# Altium schematic sheet Modbus TCP.SchDoc
size A2
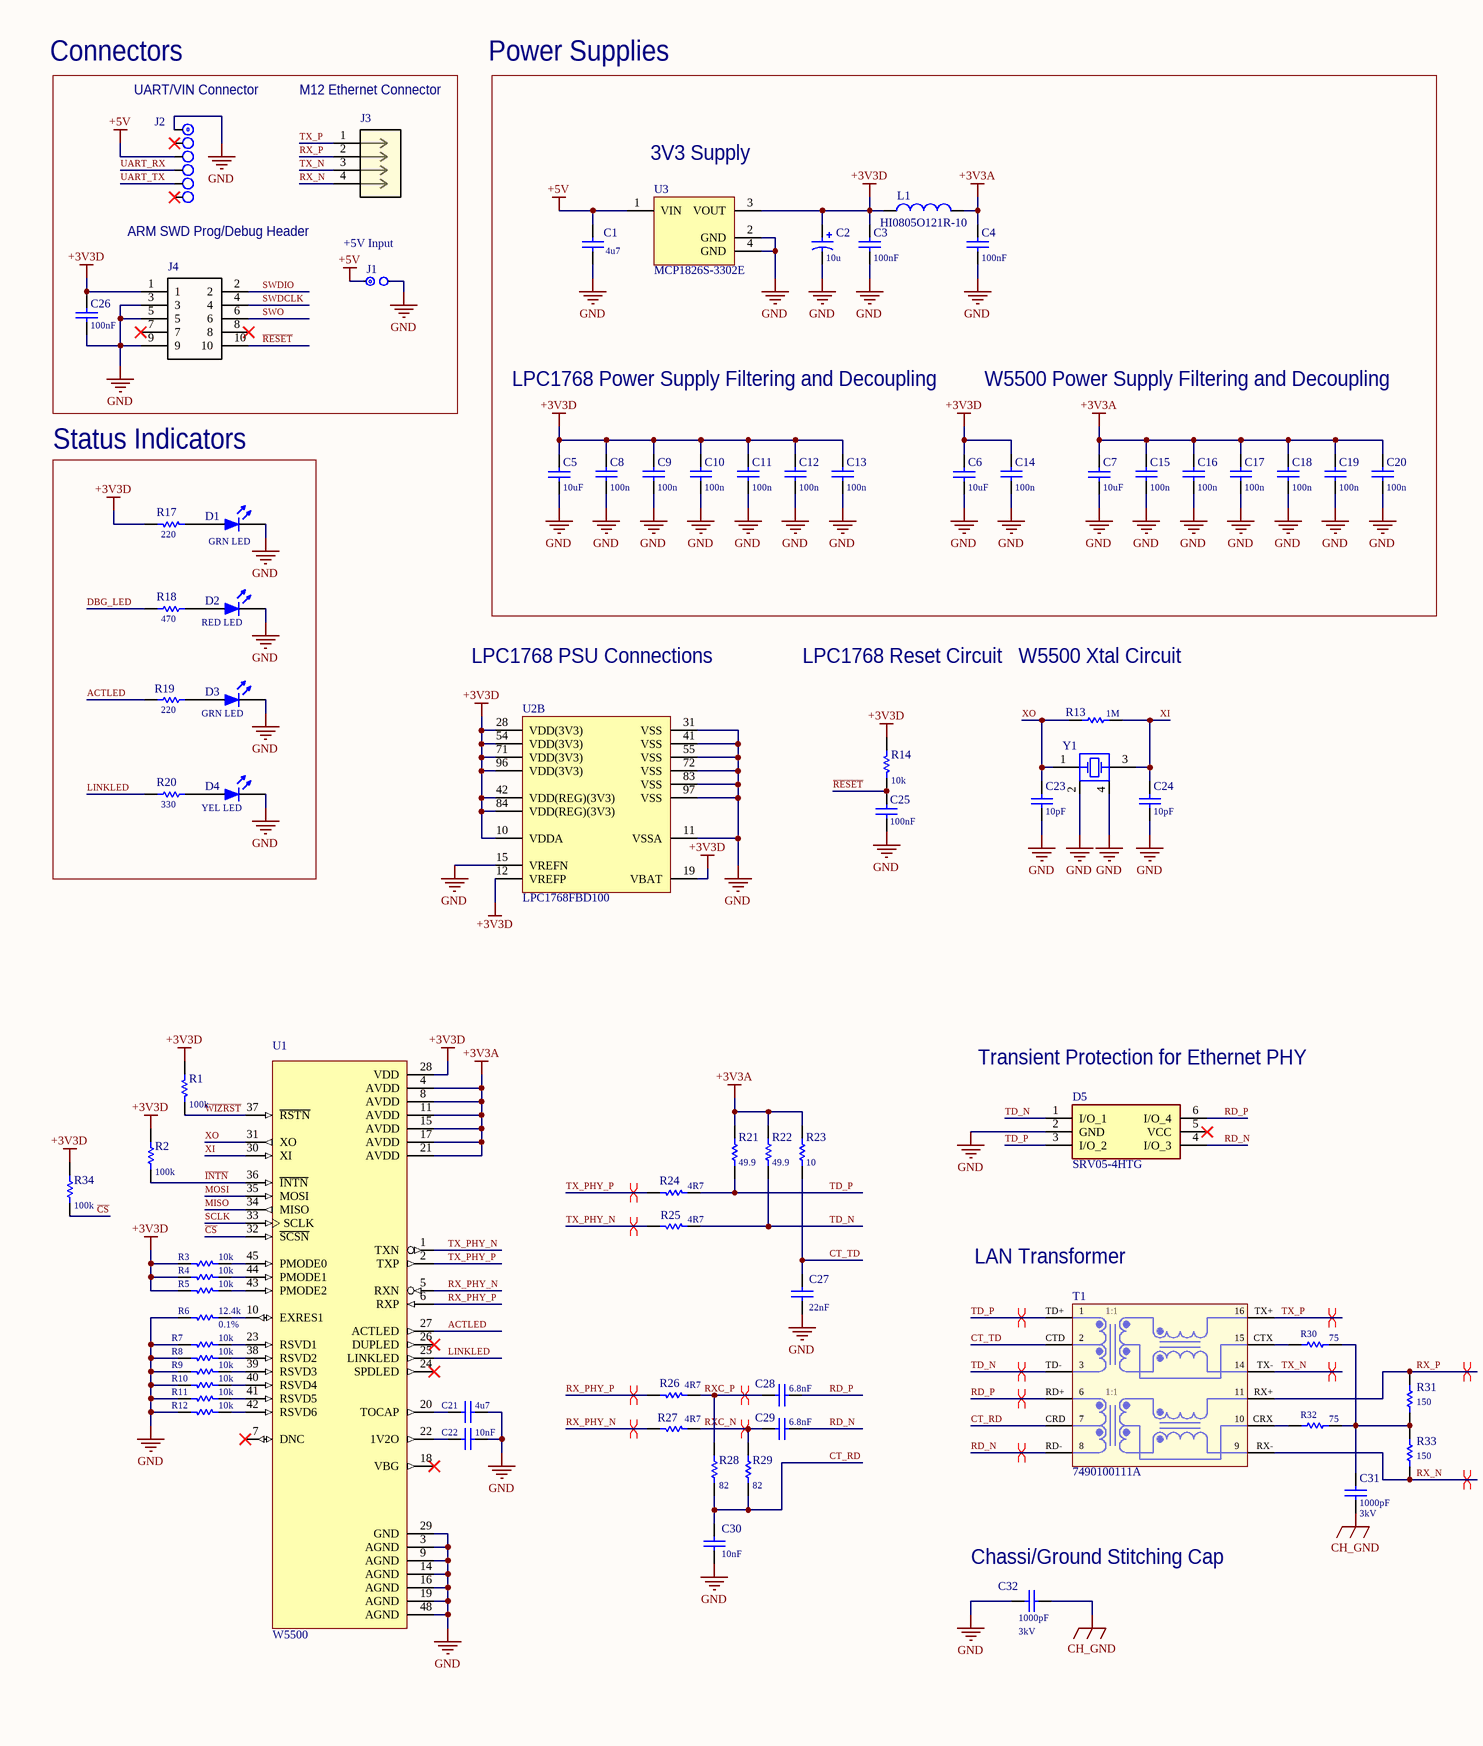
[diagram p0: Modbus TCP.SchDoc, left]
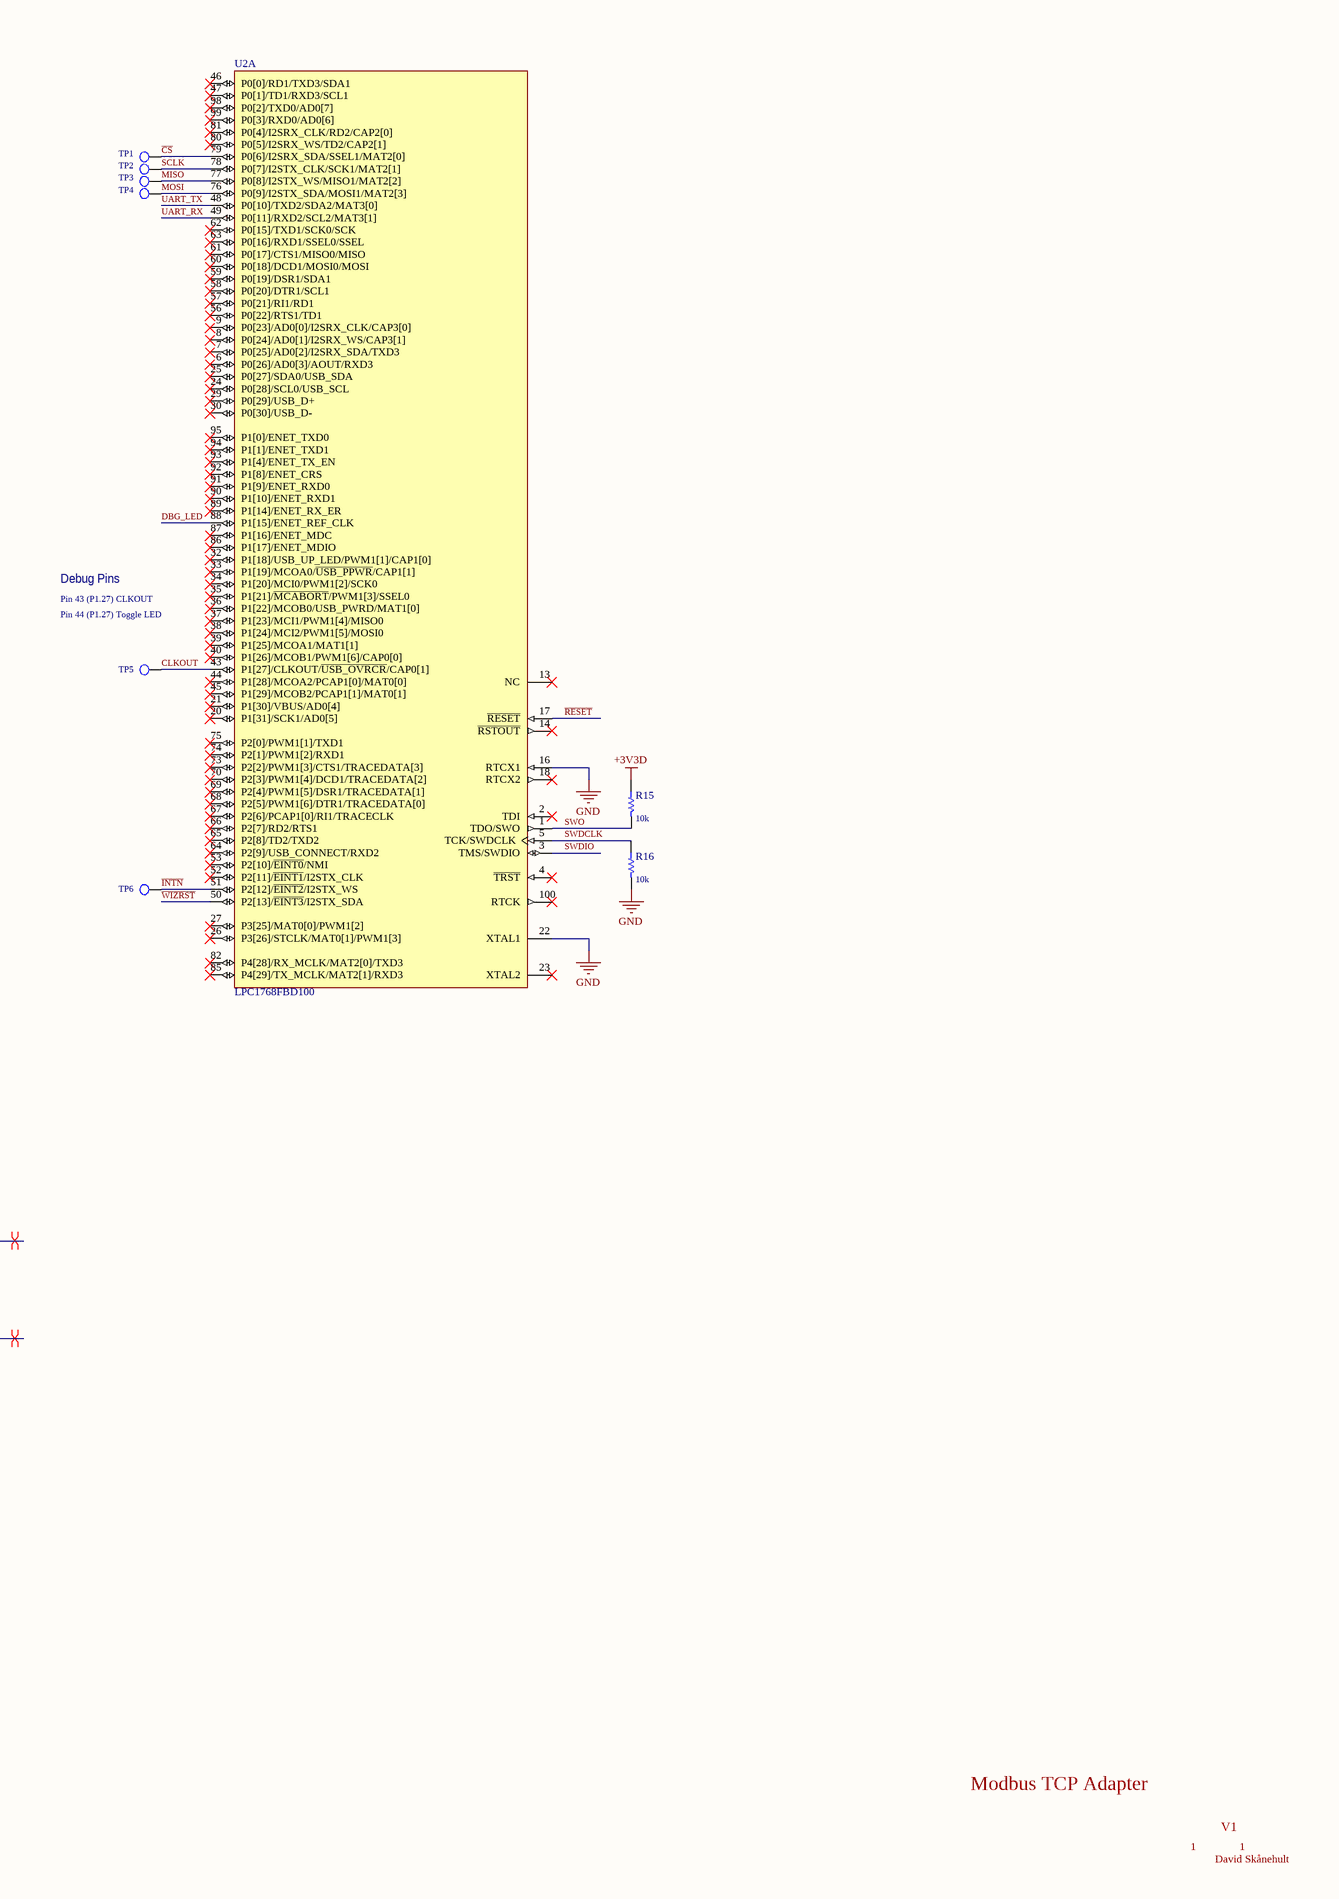
[diagram p1: Modbus TCP.SchDoc, right]

## Parts
C1  value 4u7  [C0805C475K4RACTU]  (hidden comment: CAP_0805-2012)
C2  value 10u  [CAP3528]  (hidden comment: CAP_TANT)
C3  Capacitance: 100nF  [WURTH-CSGP_0402]  (hidden comment: 100nF, 16V)
C4  Capacitance: 100nF  [WURTH-CSGP_0402]  (hidden comment: 100nF, 16V)
C5  value 10uF  [C0805C475K3RACAUTO]  (hidden comment: CAP_0805-2012)
C6  value 10uF  [C0805C475K3RACAUTO]  (hidden comment: CAP_0805-2012)
C7  value 10uF  [C0805C475K3RACAUTO]  (hidden comment: CAP_0805-2012)
C8  Capacitance: 100n  [WURTH-CSGP_0402]  (hidden comment: 100nF, 16V)
C9  Capacitance: 100n  [WURTH-CSGP_0402]  (hidden comment: 100nF, 16V)
C10  Capacitance: 100n  [WURTH-CSGP_0402]  (hidden comment: 100nF, 16V)
C11  Capacitance: 100n  [WURTH-CSGP_0402]  (hidden comment: 100nF, 16V)
C12  Capacitance: 100n  [WURTH-CSGP_0402]  (hidden comment: 100nF, 16V)
C13  Capacitance: 100n  [WURTH-CSGP_0402]  (hidden comment: 100nF, 16V)
C14  Capacitance: 100n  [WURTH-CSGP_0402]  (hidden comment: 100nF, 16V)
C15  Capacitance: 100n  [WURTH-CSGP_0402]  (hidden comment: 100nF, 16V)
C16  Capacitance: 100n  [WURTH-CSGP_0402]  (hidden comment: 100nF, 16V)
C17  Capacitance: 100n  [WURTH-CSGP_0402]  (hidden comment: 100nF, 16V)
C18  Capacitance: 100n  [WURTH-CSGP_0402]  (hidden comment: 100nF, 16V)
C19  Capacitance: 100n  [WURTH-CSGP_0402]  (hidden comment: 100nF, 16V)
C20  Capacitance: 100n  [WURTH-CSGP_0402]  (hidden comment: 100nF, 16V)
C21  value 4u7  [C0805C475K4RACTU]  (hidden comment: CAP_0805-2012)
C22  Capacitance: 10nF  [WURTH-CSGP_0402]  (hidden comment: 10nF, 25V)
C23  Capacitance: 10pF  [WURTH-CSGP_0402]  (hidden comment: 10pF, 25V)
C24  Capacitance: 10pF  [WURTH-CSGP_0402]  (hidden comment: 10pF, 25V)
C25  Capacitance: 100nF  [WURTH-CSGP_0402]  (hidden comment: 100nF, 16V)
C26  Capacitance: 100nF  [WCAP-CSGP_0402]  (hidden comment: 100nF, 16V)
C27  Capacitance: 22nF  [WURTH-CSGP_0402]  (hidden comment: 22nF, 25V)
C28  Capacitance: 6.8nF  [WURTH-CSGP_0603_Reflow]  (hidden comment: 6.8nF, 50V)
C29  Capacitance: 6.8nF  [WURTH-CSGP_0603_Reflow]  (hidden comment: 6.8nF, 50V)
C30  Capacitance: 10nF  [WURTH-CSGP_0402]  (hidden comment: 10nF, 25V)
C31  value 1000pF  Value2: 3kV  [C1812C102KHRACTU]  (hidden comment: CAP_1812-4532)
C32  value 1000pF  Value2: 3kV  [C1812C102KHRACTU]  (hidden comment: CAP_1812-4532)
D1  GRN LED  [KPG-1608]
D2  RED LED  [KPG-1608]
D3  GRN LED  [KPG-1608]
D4  YEL LED  [KPG-1608]
D5  SRV05-4HTG  [SOT95P280X145-6N]
J1  +5V Input  [J1x2]
J2  UART/VIN Connector  [HR-1x6]
J3  M12 Ethernet Connector  [CONN4_T414351204]
J4  ARM SWD Prog/Debug Header  [*SAMTEC_FTSH-105-01-L-DV-K]
L1  HI0805O121R-10  [HI0805O121R-10]
R1  value 100k  [RESC1005N - PANASONIC]  (hidden comment: RES_0402-1005)
R2  value 100k  [RESC1005N - PANASONIC]  (hidden comment: RES_0402-1005)
R3  value 10k  [RESC1005N - PANASONIC]  (hidden comment: RES_0402-1005)
R4  value 10k  [RESC1005N - PANASONIC]  (hidden comment: RES_0402-1005)
R5  value 10k  [RESC1005N - PANASONIC]  (hidden comment: RES_0402-1005)
R6  value 12.4k  Value2: 0.1%  [RESC1608N - PANASONIC ERJ]  (hidden comment: RES_0603-1608)
R7  value 10k  [RESC1005N - PANASONIC]  (hidden comment: RES_0402-1005)
R8  value 10k  [RESC1005N - PANASONIC]  (hidden comment: RES_0402-1005)
R9  value 10k  [RESC1005N - PANASONIC]  (hidden comment: RES_0402-1005)
R10  value 10k  [RESC1005N - PANASONIC]  (hidden comment: RES_0402-1005)
R11  value 10k  [RESC1005N - PANASONIC]  (hidden comment: RES_0402-1005)
R12  value 10k  [RESC1005N - PANASONIC]  (hidden comment: RES_0402-1005)
R13  value 1M  [RESC1005N - PANASONIC]  (hidden comment: RES_0402-1005)
R14  value 10k  [RESC1005N - PANASONIC]  (hidden comment: RES_0402-1005)
R15  value 10k  [RESC1005N - PANASONIC]  (hidden comment: RES_0402-1005)
R16  value 10k  [RESC1005N - PANASONIC]  (hidden comment: RES_0402-1005)
R17  value 220  [RESC1005N - PANASONIC]  (hidden comment: RES_0402-1005)
R18  value 470  [RESC1005N - PANASONIC]  (hidden comment: RES_0402-1005)
R19  value 220  [RESC1005N - PANASONIC]  (hidden comment: RES_0402-1005)
R20  value 330  [RESC1005N - PANASONIC]  (hidden comment: RES_0402-1005)
R21  value 49.9  [RESC1005N - PANASONIC]  (hidden comment: RES_0402-1005)
R22  value 49.9  [RESC1005N - PANASONIC]  (hidden comment: RES_0402-1005)
R23  value 10  [RESC1005N - PANASONIC]  (hidden comment: RES_0402-1005)
R24  value 4R7  [RESC1005N - PANASONIC]  (hidden comment: RES_0402-1005)
R25  value 4R7  [RESC1005N - PANASONIC]  (hidden comment: RES_0402-1005)
R26  value 4R7  [RESC1005N - PANASONIC]  (hidden comment: RES_0402-1005)
R27  value 4R7  [RESC1005N - PANASONIC]  (hidden comment: RES_0402-1005)
R28  value 82  [RESC1005N - PANASONIC]  (hidden comment: RES_0402-1005)
R29  value 82  [RESC1005N - PANASONIC]  (hidden comment: RES_0402-1005)
R30  value 75  [RESC1608N - PANASONIC ERJ]  (hidden comment: RES_0603-1608)
R31  value 150  [RESC1608N - PANASONIC ERJ]  (hidden comment: RES_0603-1608)
R32  value 75  [RESC1608N - PANASONIC ERJ]  (hidden comment: RES_0603-1608)
R33  value 150  [RESC1608N - PANASONIC ERJ]  (hidden comment: RES_0603-1608)
R34  value 100k  [RESC1005N - PANASONIC]  (hidden comment: RES_0402-1005)
T1  7490100111A  [7490100111A]
TP1  Test Point  [TEST_PAD]  (value not drawn)
TP2  Test Point  [TEST_PAD]  (value not drawn)
TP3  Test Point  [TEST_PAD]  (value not drawn)
TP4  Test Point  [TEST_PAD]  (value not drawn)
TP5  Test Point  [TEST_PAD]  (value not drawn)
TP6  Test Point  [TEST_PAD]  (value not drawn)
U1  W5500  [*QFP50P900X900X160-48N]
U2  LPC1768FBD100  [SOT407-1_V]  (parts A,B of 2)
U3  MCP1826S-3302E  [SOT-223-DB3_N]
Y1  XTAL 4-pin  [IQXC-42]  (value not drawn)

## Blocks framed on the sheet
Status Indicators: D1-D4 R17-R20

## Nets
+3V3A: C4.1 C7.1 C15.1 C16.1 C17.1 C18.1 C19.1 C20.1 L1.2 R21.1 R22.1 R23.1 U1.4(AVDD) U1.8(AVDD) U1.11(AVDD) U1.15(AVDD) U1.17(AVDD) U1.21(AVDD)
+3V3D: C2.2 C3.1 C5.1 C6.1 C8.1 C9.1 C10.1 C11.1 C12.1 C13.1 C14.1 C26.1 J4.1 L1.1 R1.1 R2.1 R3.2 R4.2 R5.2 R14.1 R15.1 R17.2 R34.1 U1.28(VDD) U2.10(VDDA) U2.12(VREFP) U2.19(VBAT) U2.28(VDD(3V3)) U2.42(VDD(REG)(3V3)) U2.54(VDD(3V3)) U2.71(VDD(3V3)) U2.84(VDD(REG)(3V3)) U2.96(VDD(3V3)) U3.3(VOUT)
+5V: C1.1 J1.1 J2.3 U3.1(VIN)
CH_GND: C31.2 C32.2
GND: C1.2 C2.1 C3.2 C4.2 C5.2 C6.2 C7.2 C8.2 C9.2 C10.2 C11.2 C12.2 C13.2 C14.2 C15.2 C16.2 C17.2 C18.2 C19.2 C20.2 C21.2 C22.2 C23.2 C24.2 C25.2 C26.2 C27.2 C30.2 C32.1 D1.2(K) D2.2(K) D3.2(K) D4.2(K) D5.2(GND) J1.2 J2.1 J4.3 J4.5 J4.9 R6.2 R7.2 R8.2 R9.2 R10.2 R11.2 R12.2 R16.2 U1.3(AGND) U1.9(AGND) U1.14(AGND) U1.16(AGND) U1.19(AGND) U1.29(GND) U1.48(AGND) U2.11(VSSA) U2.15(VREFN) U2.16(RTCX1) U2.22(XTAL1) U2.31(VSS) U2.41(VSS) U2.55(VSS) U2.72(VSS) U2.83(VSS) U2.97(VSS) U3.2(GND) U3.4(GND) Y1.2(GND1) Y1.4(GND2)
ACTLED: R19.1 U1.27(ACTLED)
~{CS}: R34.2 TP1.1 U1.32(~{SCSN}) U2.79(P0[6]/I2SRX_SDA/SSEL1/MAT2[0])
CLKOUT: TP5.1 U2.43(P1[27]/CLKOUT/~{USB_OVRCR}/CAP0[1])
CT_RD: C30.1 R28.1 R29.1 T1.7(CRD)
CT_TD: C27.1 R23.2 T1.2(CTD)
DBG_LED: R18.1 U2.88(P1[15]/ENET_REF_CLK)
~{INTN}: R2.2 TP6.1 U1.36(~{INTN}) U2.51(P2[12]/~{EINT2}/I2STX_WS)
LINKLED: R20.1 U1.25(LINKLED)
MISO: TP3.1 U1.34(MISO) U2.77(P0[8]/I2STX_WS/MISO1/MAT2[2])
MOSI: TP4.1 U1.35(MOSI) U2.76(P0[9]/I2STX_SDA/MOSI1/MAT2[3])
~{RESET}: C25.1 J4.10 R14.2 U2.17(~{RESET})
RD_N: C29.2 D5.4(I/O_3) T1.8(RD-)
RD_P: C28.2 D5.6(I/O_4) T1.6(RD+)
RX_N: J3.4 R33.2 T1.9(RX-)
RX_P: J3.2 R31.1 T1.11(RX+)
RX_PHY_N: R27.2 U1.5(RXN)
RX_PHY_P: R26.2 U1.6(RXP)
RXC_N: C29.1 R27.1 R29.2
RXC_P: C28.1 R26.1 R28.2
SCLK: TP2.1 U1.33(SCLK) U2.78(P0[7]/I2STX_CLK/SCK1/MAT2[1])
SWDCLK: J4.4 R16.1 U2.5(TCK/SWDCLK)
SWDIO: J4.2 U2.3(TMS/SWDIO)
SWO: J4.6 R15.2 U2.1(TDO/SWO)
TD_N: D5.1(I/O_1) R22.2 R25.1 T1.3(TD-)
TD_P: D5.3(I/O_2) R21.2 R24.1 T1.1(TD+)
TX_N: J3.3 T1.14(TX-)
TX_P: J3.1 T1.16(TX+)
TX_PHY_N: R25.2 U1.1(TXN)
TX_PHY_P: R24.2 U1.2(TXP)
UART_RX: J2.4 U2.49(P0[11]/RXD2/SCL2/MAT3[1])
UART_TX: J2.5 U2.48(P0[10]/TXD2/SDA2/MAT3[0])
~{WIZRST}: R1.2 U1.37(~{RSTN}) U2.50(P2[13]/~{EINT3}/I2STX_SDA)
XI: C24.1 R13.1 U1.30(XI) Y1.3(OSC2)
XO: C23.1 R13.2 U1.31(XO) Y1.1(OSC1)
NetC21_1: C21.1 U1.20(TOCAP)
NetC22_1: C22.1 U1.22(1V2O)
NetC31_1: C31.1 R30.2 R31.2 R32.2 R33.1
NetD1_1: D1.1(A) R17.1
NetD2_1: D2.1(A) R18.2
NetD3_1: D3.1(A) R19.2
NetD4_1: D4.1(A) R20.2
NetR3_1: R3.1 U1.45(PMODE0)
NetR4_1: R4.1 U1.44(PMODE1)
NetR5_1: R5.1 U1.43(PMODE2)
NetR6_1: R6.1 U1.10(EXRES1)
NetR7_1: R7.1 U1.23(RSVD1)
NetR8_1: R8.1 U1.38(RSVD2)
NetR9_1: R9.1 U1.39(RSVD3)
NetR10_1: R10.1 U1.40(RSVD4)
NetR11_1: R11.1 U1.41(RSVD5)
NetR12_1: R12.1 U1.42(RSVD6)
NetR30_1: R30.1 T1.15(CTX)
NetR32_1: R32.1 T1.10(CRX)

Not connected (* = marked no-connect by the designer): D5 5(VCC)*; J2 2* 6*; J4 7* 8*; U1 7(DNC)* 18(VBG)* 24(SPDLED)* 26(DUPLED)*; U2 2(TDI)* 4(~{TRST})* 6(P0[26]/AD0[3]/AOUT/RXD3)* 7(P0[25]/AD0[2]/I2SRX_SDA/TXD3)* 8(P0[24]/AD0[1]/I2SRX_WS/CAP3[1])* 9(P0[23]/AD0[0]/I2SRX_CLK/CAP3[0])* 13(NC)* 14(~{RSTOUT})* 18(RTCX2)* 20(P1[31]/SCK1/AD0[5])* 21(P1[30]/VBUS/AD0[4])* 23(XTAL2)* 24(P0[28]/SCL0/USB_SCL)* 25(P0[27]/SDA0/USB_SDA)* 26(P3[26]/STCLK/MAT0[1]/PWM1[3])* 27(P3[25]/MAT0[0]/PWM1[2])* 29(P0[29]/USB_D+)* 30(P0[30]/USB_D-)* 32(P1[18]/USB_UP_LED/PWM1[1]/CAP1[0])* 33(P1[19]/MCOA0/~{USB_PPWR}/CAP1[1])* 34(P1[20]/MCI0/PWM1[2]/SCK0)* 35(P1[21]/~{MCABORT}/PWM1[3]/SSEL0)* 36(P1[22]/MCOB0/USB_PWRD/MAT1[0])* 37(P1[23]/MCI1/PWM1[4]/MISO0)* 38(P1[24]/MCI2/PWM1[5]/MOSI0)* 39(P1[25]/MCOA1/MAT1[1])* 40(P1[26]/MCOB1/PWM1[6]/CAP0[0])* 44(P1[28]/MCOA2/PCAP1[0]/MAT0[0])* 45(P1[29]/MCOB2/PCAP1[1]/MAT0[1])* 46(P0[0]/RD1/TXD3/SDA1)* 47(P0[1]/TD1/RXD3/SCL1)* 52(P2[11]/~{EINT1}/I2STX_CLK)* 53(P2[10]/~{EINT0}/NMI)* 56(P0[22]/RTS1/TD1)* 57(P0[21]/RI1/RD1)* 58(P0[20]/DTR1/SCL1)* 59(P0[19]/DSR1/SDA1)* 60(P0[18]/DCD1/MOSI0/MOSI)* 61(P0[17]/CTS1/MISO0/MISO)* 62(P0[15]/TXD1/SCK0/SCK)* 63(P0[16]/RXD1/SSEL0/SSEL)* 64(P2[9]/USB_CONNECT/RXD2)* 65(P2[8]/TD2/TXD2)* 66(P2[7]/RD2/RTS1)* 67(P2[6]/PCAP1[0]/RI1/TRACECLK)* 68(P2[5]/PWM1[6]/DTR1/TRACEDATA[0])* 69(P2[4]/PWM1[5]/DSR1/TRACEDATA[1])* 70(P2[3]/PWM1[4]/DCD1/TRACEDATA[2])* 73(P2[2]/PWM1[3]/CTS1/TRACEDATA[3])* 74(P2[1]/PWM1[2]/RXD1)* 75(P2[0]/PWM1[1]/TXD1)* 80(P0[5]/I2SRX_WS/TD2/CAP2[1])* 81(P0[4]/I2SRX_CLK/RD2/CAP2[0])* 82(P4[28]/RX_MCLK/MAT2[0]/TXD3)* 85(P4[29]/TX_MCLK/MAT2[1]/RXD3)* 86(P1[17]/ENET_MDIO)* 87(P1[16]/ENET_MDC)* 89(P1[14]/ENET_RX_ER)* 90(P1[10]/ENET_RXD1)* 91(P1[9]/ENET_RXD0)* 92(P1[8]/ENET_CRS)* 93(P1[4]/ENET_TX_EN)* 94(P1[1]/ENET_TXD1)* 95(P1[0]/ENET_TXD0)* 98(P0[2]/TXD0/AD0[7])* 99(P0[3]/RXD0/AD0[6])* 100(RTCK)*

## Layout directives
differential pair: RD_N, RD_P, RX_N, RX_P, RX_PHY_N, RX_PHY_P, RXC_N, RXC_P, TD_N, TD_P, TX_N, TX_P, TX_PHY_N, TX_PHY_P

## Notes on the sheet
- Connectors
- Power Supplies
- (near U3) 3V3 Supply
- LPC1768 Power Supply Filtering and Decoupling
- W5500 Power Supply Filtering and Decoupling
- Debug Pins
- LPC1768 PSU Connections
- LPC1768 Reset Circuit
- (near R13) W5500 Xtal Circuit
- Pin 43 (P1.27) CLKOUT
- Pin 44 (P1.27) Toggle LED
- (near D5) Transient Protection for Ethernet PHY
- (near T1) LAN Transformer
- (near C32) Chassi/Ground Stitching Cap
- Modbus TCP Adapter
- 1
- David Skånehult
- V1

## Library data of the parts
C1 C21 = CAP_0805-2012: CAP, CERM, 4.7 uF, 16 V, +/- 10%, X7R, 0805; Value2: 16V; PackageReference: C0805; PackageDescription: 0805 Cap; PartNumber: C0805C475K4RACTU
C2 = CAP_TANT: CAP, TANT, 10 uF, 16 V, +/- 20%, MnO2, 3528; PartNumber: T494B106M016AT; Value2: 16V; Published: 8-Jun-2000; LatestRevisionDate: 17-Jul-2002; LatestRevisionNote: Re-released for DXP Platform.; PackageReference: TANTAL; Publisher: Altium Limited; PackageDescription: Tantalum Capacitor, SMD
C3 C4 C8-C20 C25 C26 = 885012205037: WCAP-CSGP General Purpose Ceramic Capacitors, size 0402, 100nF, +/-10%, 16VDC; Isolation Resistance: >=5GOhm; Ceramic Type: X7R; Technical Reference: X7R0402104K016DFCT10000; Publisher: Wurth Elektronik; ComponentLink1Description: Manufacturer; ComponentLink1URL: http://www.we-online.de; ComponentLink2Description: Datasheet; ComponentLink2URL: https://katalog.we-online.com/pbs/datasheet/885012205037.pdf; Operating Temperature: -55 to +125degC; Packaging: Tape and Reel; Part Number: 885012205037; Rated Voltage: 16VDC; Published Date: August 2019; Capacitance Tolerance: +/-10%; Dissipation Factor: =<5%; Height: 0.5mm +/-0.05mm; Mounting Technology: SMD; Size: 0402
C5-C7 = CAP_0805-2012: CAP, CERM, 10 uF, 16 V, +/- 10%, X5R, 0805; PartNumber: C0805C106K4PACTU; Value2: 16V; PackageReference: C0805; PackageDescription: 0805 Cap
C22 C30 = 885012205050: WCAP-CSGP General Purpose Ceramic Capacitors, size 0402, 10nF, +/-10%, 25VDC; Isolation Resistance: >=10GOhm; Ceramic Type: X7R; Technical Reference: X7R0402103K025DFCT10000; Publisher: Wurth Elektronik; ComponentLink1Description: Manufacturer; ComponentLink1URL: http://www.we-online.de; ComponentLink2Description: Datasheet; ComponentLink2URL: https://katalog.we-online.com/pbs/datasheet/885012205050.pdf; Operating Temperature: -55 to +125degC; Packaging: Tape and Reel; Part Number: 885012205050; Rated Voltage: 25VDC; Published Date: August 2019; Capacitance Tolerance: +/-10%; Dissipation Factor: =<3.5%; Height: 0.5mm +/-0.05mm; Mounting Technology: SMD; Size: 0402
C23 C24 = 885012005040: WCAP-CSGP General Purpose Ceramic Capacitors, size 0402, 10pF, +/-5%, 25VDC; Isolation Resistance: >=10GOhm; Ceramic Type: NP0; Dissipation Factor: Q>=400+20C; Technical Reference: NP00402100J025DFCT10000; Publisher: Wurth Elektronik; ComponentLink1Description: Manufacturer; ComponentLink1URL: http://www.we-online.de; ComponentLink2Description: Datasheet; ComponentLink2URL: https://katalog.we-online.com/pbs/datasheet/885012005040.pdf; Operating Temperature: -55 to +125degC; Packaging: Tape and Reel; Part Number: 885012005040; Rated Voltage: 25VDC; Published Date: August 2019; Capacitance Tolerance: +/-5%; Height: 0.5mm +/-0.05mm; Mounting Technology: SMD; Size: 0402
C27 = 885012205052: WCAP-CSGP General Purpose Ceramic Capacitors, size 0402, 22nF, +/-10%, 25VDC; Isolation Resistance: >=10GOhm; Ceramic Type: X7R; Technical Reference: X7R0402223K025DFCT10000; Publisher: Wurth Elektronik; ComponentLink1Description: Manufacturer; ComponentLink1URL: http://www.we-online.de; ComponentLink2Description: Datasheet; ComponentLink2URL: https://katalog.we-online.com/pbs/datasheet/885012205052.pdf; Operating Temperature: -55 to +125degC; Packaging: Tape and Reel; Part Number: 885012205052; Rated Voltage: 25VDC; Published Date: August 2019; Capacitance Tolerance: +/-10%; Dissipation Factor: =<3.5%; Height: 0.5mm +/-0.05mm; Mounting Technology: SMD; Size: 0402
C28 C29 = 885012206088: WCAP-CSGP General Purpose Ceramic Capacitors, size 0603, 6.8nF, +/-10%, 50VDC; Isolation Resistance: >=10GOhm; Ceramic Type: X7R; Technical Reference: X7R0603682K050DFCT10000; Publisher: Wurth Elektronik; ComponentLink1Description: Manufacturer; ComponentLink1URL: http://www.we-online.de; ComponentLink2Description: Datasheet; ComponentLink2URL: https://katalog.we-online.com/pbs/datasheet/885012206088.pdf; Operating Temperature: -55 to +125degC; Packaging: Tape and Reel; Part Number: 885012206088; Rated Voltage: 50VDC; Published Date: August 2019; Capacitance Tolerance: +/-10%; Dissipation Factor: =<2.5%; Height: 0.8mm +/-0.07mm; Mounting Technology: SMD; Size: 0603
C31 C32 = CAP_1812-4532: CAP, CERM, 1000 pF, 3 kV, +/- 10%, X7R, 1812; PackageReference: C1812; PackageDescription: 1812 Cap; PartNumber: C1812C102KHRACTU
D1 D3 = LED: KPG-1608CGKC-T; PCB_Layout: Complies with manufacturer's recommendation.; Value: Green; Published: 14-Mar-2008; DatasheetVersion: Mar-2007; PackageVersion: Mar-2007; Publisher: Altium Limited; ComponentLink1Description: Manufacturer Link; ComponentLink1URL: http://www.osram-os.com/; ComponentLink2Description: Datasheet; ComponentLink2URL: http://catalog.osram-os.com/catalogue/catalogue.do;jsessionid=AD571800CED0208623E7FAFDF556DB1C?act=downloadFile&favOid=020000030001e106000200b6; PartNumber: KPG-1608CGKC-T
D2 = LED: KPG-1608SURKC-T; PCB_Layout: Complies with manufacturer's recommendation.; Value: Green; Published: 14-Mar-2008; DatasheetVersion: Mar-2007; PackageVersion: Mar-2007; Publisher: Altium Limited; ComponentLink1Description: Manufacturer Link; ComponentLink1URL: http://www.osram-os.com/; ComponentLink2Description: Datasheet; ComponentLink2URL: http://catalog.osram-os.com/catalogue/catalogue.do;jsessionid=AD571800CED0208623E7FAFDF556DB1C?act=downloadFile&favOid=020000030001e106000200b6; PartNumber: KPG-1608SURKC-T
D4 = LED: PartNumber: KPG-1608SYKC-T; PCB_Layout: Complies with manufacturer's recommendation.; Value: Yellow; Published: 14-Mar-2008; DatasheetVersion: Mar-2007; PackageVersion: Mar-2007; Publisher: Altium Limited; ComponentLink1Description: Manufacturer Link; ComponentLink1URL: http://www.osram-os.com/; ComponentLink2Description: Datasheet; ComponentLink2URL: http://catalog.osram-os.com/catalogue/catalogue.do;jsessionid=AD571800CED0208623E7FAFDF556DB1C?act=downloadFile&favOid=020000030001e106000200b6
D5 = SRV05-4HTG: TVS Diode (Uni-directional); Manufacturer_Name: LITTELFUSE; Allied_Number: 70519501; Datasheet Link: http://uk.rs-online.com/web/p/products/7931986P; Height: 1.45mm; RS Part Number: 7931986P; RS Price/Stock: http://uk.rs-online.com/web/p/products/7931986P; Manufacturer_Part_Number: SRV05-4HTG
J1 = H-1x2: Price: 0.02
J2 = HR-1x6: Price: 0.06
J3 = T4143512041-000: M12,FRONT MOUNTING,FEMALE,D CODE,4P; Vendor: TE Connectivity; POSITIONS: 4; Built_By: EMA_UL_Team; Copyright: Copyright (C) 2016 Accelerated Designs. All rights reserved; PartNumber: T4143512041-000; TE_Part_Number: T4143512041-000; PRODUCT: Connector; Type: DEV; ROWS/CONFIG: -; PITCH(MM): -; Datasheet: https://www.te.com/commerce/DocumentDelivery/DDEController?Action=showdoc&DocId=Customer+Drawing%7FT41435120X1000%7FB1%7Fpdf%7FEnglish%7FENG_CD_T41435120X1000_B1.pdf%7FT4143512041-000; RefDes: RefDes; Value: Value
J4 = FTSH-105-01-L-DV-K: FTSH Series .050 Micro Terminal Strip; MF: Samtec; Price: None; Package: TSSOP-20 Texas Instruments; PartNumber: FTSH-105-01-L-DV-K; SnapEDA_Link: https://www.snapeda.com/parts/FTSH-105-01-L-DV-K/Samtec%20Inc./view-part/?ref=snap; Availability: Unavailable; Value: *
L1 = FERRITE: Laird HI0805O121R-10 Ferrite Bead; Value2: 3.5 A; Value: 120 ohm; PartNumber: HI0805O121R-10
R1 R2 R34 = RES_0402-1005: RES, 100 k, 1%, 0.1 W, 0402; PartNumber: ERJ2RKF1003X; PackageReference: R0402; PackageDescription: 0402 Res; Value2: 1%
R3-R5 R7-R12 R14-R16 = RES_0402-1005: RES, 10 k, 1%, 0.1 W, 0402; PartNumber: ERJ2RKF1002X; PackageReference: R0402; PackageDescription: 0402 Res; Value2: 1%
R6 = RES_0603-1608: RES, 12.4 k, 0.1%, 0.1 W, 0603; PartNumber: ERA3AEB1242V; PackageReference: R0805; PackageDescription: 0805 Res
R13 = RES_0402-1005: RES, 1 Meg, 1%, 0.1 W, 0402; PartNumber: ERJ2RKF1004X; PackageReference: R0402; PackageDescription: 0402 Res; Value2: 1%
R17 R19 = RES_0402-1005: RES, 220, 1%, 0.1 W, 0402; PartNumber: ERJ2RKF2200X; PackageReference: R0402; PackageDescription: 0402 Res; Value2: 1%
R18 = RES_0402-1005: RES, 470, 1%, 0.1 W, 0402; PartNumber: ERJ2RKF4700X; PackageReference: R0402; PackageDescription: 0402 Res; Value2: 1%
R20 = RES_0402-1005: RES, 220, 1%, 0.1 W, 0402; PartNumber: ERJ2RKF3300X; PackageReference: R0402; PackageDescription: 0402 Res; Value2: 1%
R21 R22 = RES_0402-1005: RES, 49.9, 1%, 0.1 W, 0402; PartNumber: ERJ2RKF49R9X; PackageReference: R0402; PackageDescription: 0402 Res; Value2: 1%
R23 = RES_0402-1005: RES, 10, 1%, 0.1 W, 0402; PackageReference: R0402; PackageDescription: 0402 Res; Value2: 1%
R24-R27 = RES_0402-1005: RES, 4R7, 1%, 0.1 W, 0402; PartNumber: CRCW04024R70FKEDHP; PackageReference: R0402; PackageDescription: 0402 Res; Value2: 1%
R28 R29 = RES_0402-1005: 0402 Resistor; PartNumber: ERJ2RKF82R0X; Value2: 1%; PackageReference: R0402; PackageDescription: 0402 Res
R30 R32 = RES_0603-1608: RES, 75, 1%, 0.1 W, 0603; PartNumber: CRCW060375R0FKEA; PackageReference: R0805; PackageDescription: 0805 Res; Value2: 1%
R31 R33 = RES_0603-1608: RES, 150, 1%, 0.1 W, 0603; PartNumber: CRCW0603150RFKEA; PackageReference: R0805; PackageDescription: 0805 Res; Value2: 1%
T1 = 7490100111A: WE-LAN LAN Transformer, SMT, 10/100 Base-T, 1 Port, non-PoE; Number of Ports: 1; Turns Ratio: 1:1; HPLE: No; Inductance: 350uH; Insulation Test Voltage: 1500V (RMS); ComponentLink1Description: Manufacturer; ComponentLink1URL: http://www.we-online.de; ComponentLink2Description: Datasheet; ComponentLink2URL: https://katalog.we-online.com/pbs/datasheet/7490100111A.pdf; PartNumber: 7490100111A; Published Date: September 2019; Publisher: Wurth Elektronik; PoE: non-PoE; Data Rate: 10/100 Base-T; Operating Temperature: -40 to +105degC; Mounting Technology: SMT; Packaging: Tape and Reel
TP1-TP6 = Test Point: Test Pad; LatestRevisionDate: 17-Jul-2002; LatestRevisionNote: Re-released for DXP Platform.; Publisher: Altium Limited
U1 = W5500: Ethernet Controller 10/100 Base-T/TX MAC PHY SPI QFP48; MF: WIZnet; SnapEDA_Link: https://www.snapeda.com/parts/W5500/WIZnet/view-part/?ref=snap; Availability: Unavailable; Price: None; MP: W5500; Package: LQFP-48 Victor Technologies; Value: *
U2 = LPC1768FBD100: 32-bit ARM Cortex-M3 MCU, 512 kB Flash, 64 kB SRAM, Ethernet, USB 2.0 Device/Host/OTG, 12-Bit ADC, DAC, I2S, 100-Pin LQFP; fmax: 100 MHz; SRAM: 64 kB; Flash: 512 kB; GPIOs: 70; USB: 1; CAN: 2; UART: 4; PWM: 6; PLL: Y; ADC channels: 8; VDD (min): 2.4 V; VDD (typ): 3.3 V; VDD (max): 3.6 V; Code_IEC: 136E20; DatasheetVersion: Rev. 8, Nov-2011; PackageVersion: Feb-2003; PackageReference: SOT407-1; PackageDescription: LQFP100: Plastic Low Profile Quad Flat Package; 100 Leads; Body 14 x 14 x 1.4 mm; SPI: 1; SSP: 2; Timers: 4; Code_JEDEC: MS-026; PartNumber: LPC1768FBD100; ComponentLink1Description: Manufacturer URL; ComponentLink1URL: http://www.nxp.com/; ComponentLink2Description: Datasheet; ComponentLink2URL: http://www.nxp.com/documents/data_sheet/LPC1769_68_67_66_65_64_63.pdf
U3 = MCP1826S-3302E/DB: 1000 mA, Low Voltage, Low Quiescent Current LDO Regulator, 3-Pin SOT-223, Extended Temperature; Manufacturer: Microchip; DatasheetVersion: revA, Aug-2007; PackageVersion: revBB, Aug-2009; PackageReference: SOT-223-DB3; PackageDescription: 3-Lead Plastic Small Outline Transistor (DB) [SOT-223]; Supplier 1: Digi-Key; Supplier Part Number 1: MCP1826S-3302E/DB-ND; Supplier 2: Newark; Supplier Part Number 2: 27M0037; Supplier 3: Mouser; Supplier Part Number 3: 579-MCP1826S-3302EDB; Mounting Technology: Surface Mount; PartNumber: MCP1826S-3302E/DB; ComponentLink1Description: Manufacturer URL; ComponentLink1URL: http://www.microchip.com/; ComponentLink2Description: Datasheet; ComponentLink2URL: http://ww1.microchip.com/downloads/en/DeviceDoc/22057a.pdf; ComponentLink3Description: Package Specification; ComponentLink3URL: http://www.microchip.com/stellent/groups/techpub_sg/documents/packagingspec/en012702.pdf
Y1 = XTAL 4-pin: Crystal Oscillator; PartNumber: LFXTAL069494; Published: 8-Jun-2000; LatestRevisionDate: 17-Jul-2002; LatestRevisionNote: Re-released for DXP Platform.; PackageReference: R38; Publisher: Altium Limited; PackageDescription: Crystal, Thru-Hole; 2 Leads; Body 3.1 x 8.2 mm (Dia.xH)